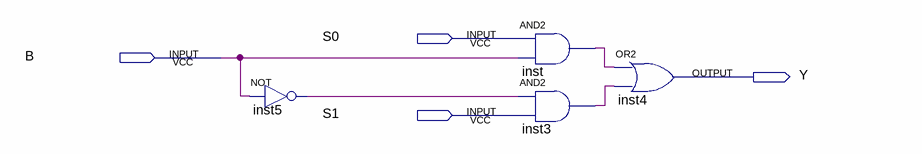
[diagram p0: schematic sheet]
// Quartus schematic Operand.bdf as structural Verilog: 4 symbols, 4 pins
module Operand (
  input  S0,
  input  B,
  input  S1,
  output Y
);

  wire inst3_out, inst5_out, inst_out;

  not inst5 (inst5_out, B);
  and inst (inst_out, S0, B);
  and inst3 (inst3_out, inst5_out, S1);
  or inst4 (Y, inst_out, inst3_out);
endmodule
